# EAGLE design 3DAGM (EAGLE 6.6.0)
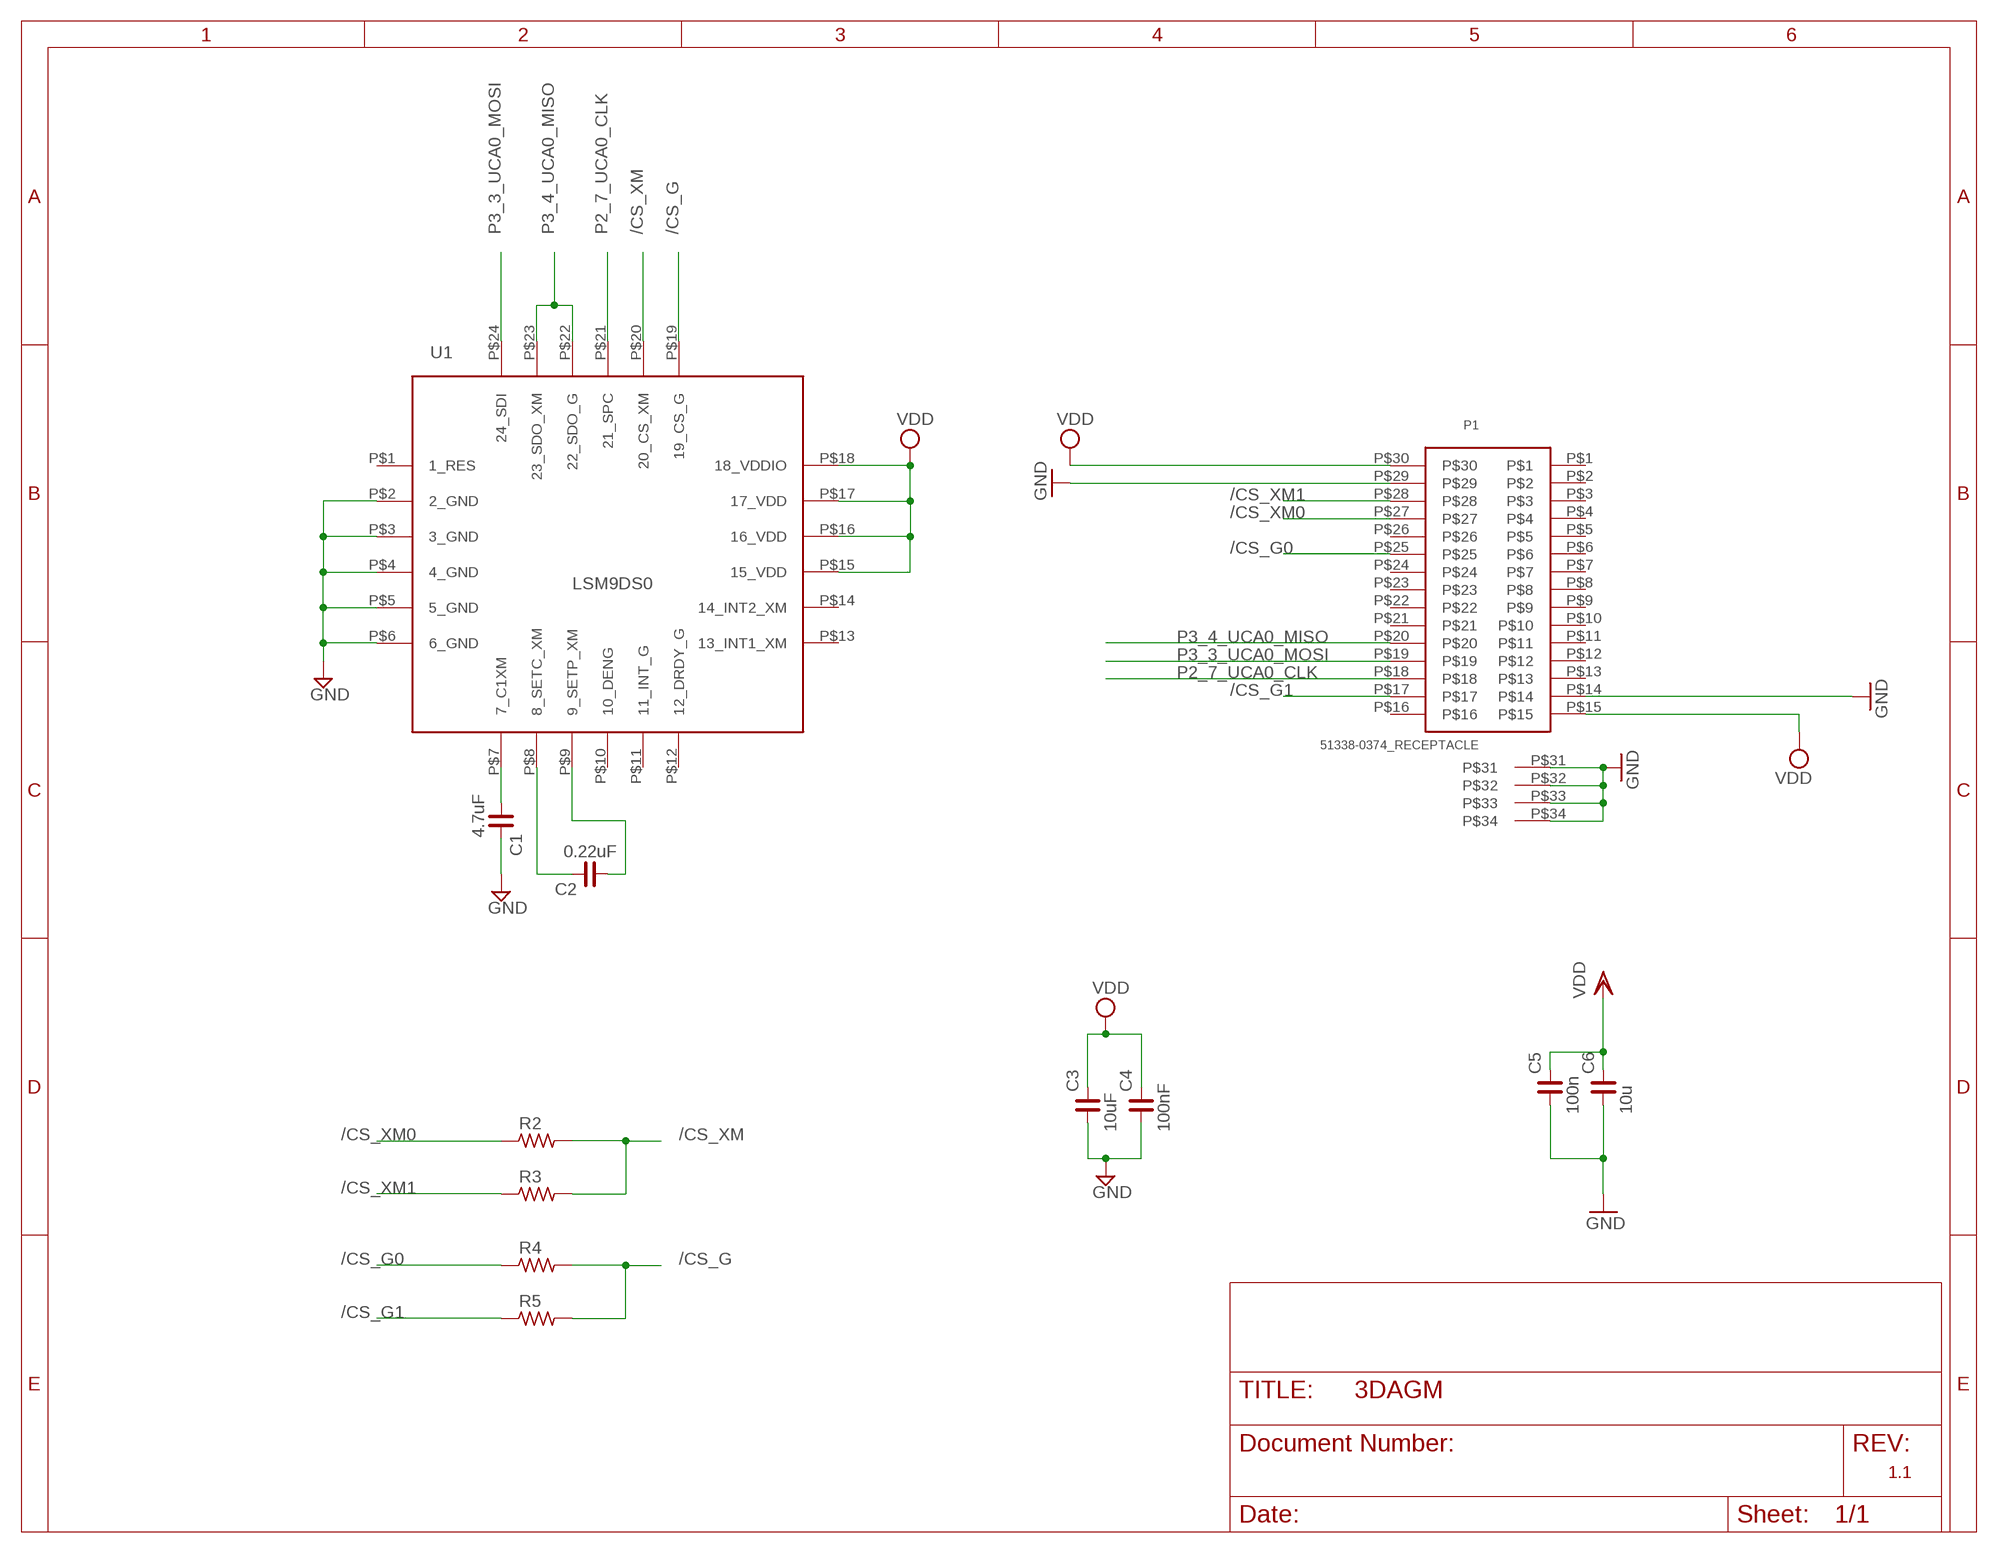
[diagram p0: schematic, sheet 1]

## Parts
C1  4.7uF  C_0402  [C0402]
C2  0.22uF  C_0402  [C0402]
C3  10uF  C_0402  [C0402]
C4  100nF  C_0402  [C0402]
C5  100n  C_0402  [C0402]
C6  10u  C_0402  [C0402]
P1  51338-0374_RECEPTACLE  [51338-0374_RECEPTACLE]
R2  R_0402  [R0402]
R3  R_0402  [R0402]
R4  R_0402  [R0402]
R5  R_0402  [R0402]
U$1  LSM9DS09DOFS0  [LGA24(4X4X1)]

## Nets
/CS_G: R4.2 R5.2 U$1.P$19(19_CS_G)
/CS_G0: P1.P$25 R4.1
/CS_G1: P1.P$17 R5.1
/CS_XM: R2.2 R3.2 U$1.P$20(20_CS_XM)
/CS_XM0: P1.P$27 R2.1
/CS_XM1: P1.P$28 R3.1
GND: C1.2 C3.1 C4.1 C5.1 C6.1 P1.P$14 P1.P$29 P1.P$31 P1.P$32 P1.P$33 P1.P$34 U$1.P$2(2_GND) U$1.P$3(3_GND) U$1.P$4(4_GND) U$1.P$5(5_GND) U$1.P$6(6_GND)
N$1: C1.1 U$1.P$7(7_C1XM)
N$2: C2.2 U$1.P$8(8_SETC_XM)
N$3: C2.1 U$1.P$9(9_SETP_XM)
P2_7_UCA0_CLK: P1.P$18 U$1.P$21(21_SPC)
P3_3_UCA0_MOSI: P1.P$19 U$1.P$24(24_SDI)
P3_4_UCA0_MISO: P1.P$20 U$1.P$22(22_SDO_G) U$1.P$23(23_SDO_XM)
VDD: C3.2 C4.2 C5.2 C6.2 P1.P$15 P1.P$30 U$1.P$15(15_VDD) U$1.P$16(16_VDD) U$1.P$17(17_VDD) U$1.P$18(18_VDDIO)
Unconnected: P1.P$1 P1.P$2 P1.P$3 P1.P$4 P1.P$5 P1.P$6 P1.P$7 P1.P$8 P1.P$9 P1.P$10 P1.P$11 P1.P$12 P1.P$13 P1.P$16 P1.P$21 P1.P$22 P1.P$23 P1.P$24 P1.P$26 U$1.P$1(1_RES) U$1.P$10(10_DENG) U$1.P$11(11_INT_G) U$1.P$12(12_DRDY_G) U$1.P$13(13_INT1_XM) U$1.P$14(14_INT2_XM)

## Notes on the sheet
- U1
- 1.1

## Library data of the parts
C1-C6 = rc-master-smd:C_: NON-POLARIZED CAP
P1 = Molex_SlimStack:51338-0374_RECEPTACLE
R2-R5 = rc-master-smd:R_: RESISTOR
U$1 = lsm9ds0:LSM9DS0

## Board
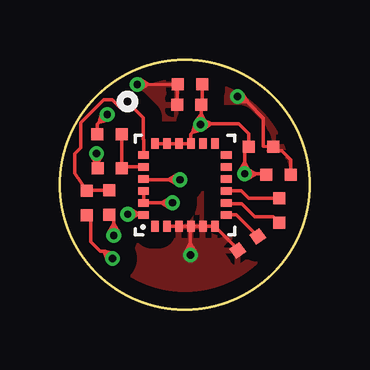
[diagram p1: board, top side]
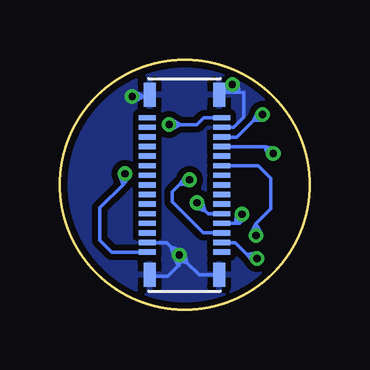
[diagram p2: board, bottom side, seen from below]

Size 10.4 x 10.4 mm. Coordinates in mm from the lower left corner, seen from the top.
Outline: circle at 5.2,5.2 radius 5.2
Copper layers (1*16): Top 0.035mm / dielectric 1.5mm / Bottom 0.035mm
Design rules "DIRTY_PCB": minimum track width 5mil, minimum drill 12mil, track to track 5mil, track to pad 5mil, pad to pad 5mil, via to via 5mil, smd to smd 0mil, copper to edge 10mil, drill to drill 10mil, minimum pad ring 10mil, minimum via ring 6mil, stop-mask expansion 2mil, vias tented up to drill 25mil, thermal gap 10mil

### Footprints (pad centres in the part's own frame; a part is rotated, then mirrored left to right if it is on the bottom)
C0402 = smd 0.5 x 0.5: 1 -0.508,0; 2 0.508,0
51338-0374_RECEPTACLE = smd 0.7 x 0.22: P$1 -1.55,2.8; P$2 -1.55,2.4; P$3 -1.55,2; P$4 -1.55,1.6; P$5 -1.55,1.2; P$6 -1.55,0.8; P$7 -1.55,0.4; P$8 -1.55,0; P$9 -1.55,-0.4; P$10 -1.55,-0.8; P$11 -1.55,-1.2; P$12 -1.55,-1.6; P$13 -1.55,-2; P$14 -1.55,-2.4; P$15 -1.55,-2.8; P$16 1.55,-2.8; P$17 1.55,-2.4; P$18 1.55,-2; P$19 1.55,-1.6; P$20 1.55,-1.2; P$21 1.55,-0.8; P$22 1.55,-0.4; P$23 1.55,0; P$24 1.55,0.4; P$25 1.55,0.8; P$26 1.55,1.2; P$27 1.55,1.6; P$28 1.55,2; P$29 1.55,2.4; P$30 1.55,2.8 | smd 0.5 x 1: P$31 1.45,3.75; P$32 -1.45,3.75; P$33 -1.45,-3.75; P$34 1.45,-3.75
R0402 = smd 0.5 x 0.5: 1 -0.508,0; 2 0.508,0
LGA24(4X4X1) = smd 0.45 x 0.3: P$1 -1.725,1.25; P$2 -1.725,0.75; P$3 -1.725,0.25; P$4 -1.725,-0.25; P$5 -1.725,-0.75; P$6 -1.725,-1.25; P$13 1.725,-1.25; P$14 1.725,-0.75; P$15 1.725,-0.25; P$16 1.725,0.25; P$17 1.725,0.75; P$18 1.725,1.25 | smd 0.3 x 0.45: P$7 -1.25,-1.725; P$8 -0.75,-1.725; P$9 -0.25,-1.725; P$10 0.25,-1.725; P$11 0.75,-1.725; P$12 1.25,-1.725; P$19 1.25,1.725; P$20 0.75,1.725; P$21 0.25,1.725; P$22 -0.25,1.725; P$23 -0.75,1.725; P$24 -1.25,1.725

### Placement (x,y rotation side)
C1  7.82,2.76 215 top
C2  9.14,4.12 270 top
C3  5.39,8.54 0 top
C4  5.42,9.4 0 top
C5  9.11,5.63 180 top
C6  8.38,6.78 180 top
P1  5.21,5.19 0 bottom
R2  2.07,5.9 0 top
R3  2.07,7.3 0 top
R4  2.06,4.47 90 top
R5  1.12,4.44 90 top
U$1  5.21,5.19 90 top

### Tracks (layer width: path | path; a pad name or v marks a point on that pad's centre or on a via)
/CS_G
  Top 0.152: R4.2 1.33,4.97 R5.2 0.62,5.67 0.62,6.5 0.87,6.75 0.87,7.78 1.83,8.74 2.19,8.74 2.52,8.41 3,8.41 3.03,8.44 3.47,8 3.47,7.1 3.48,7.09 U$1.P$19
/CS_G0  (via drill 0.3)
  Top 0.152: R4.1 2.24,3.94 2.24,3.55 | 2.24,3.55 v2.24,3.09 | 2.24,3.55 2.04,3.21 v2.24,3.09 | 2.24,3.55 2.44,3.21 v2.24,3.09
  Bottom 0.152: P1.P$25 2.14,6 1.62,5.48 1.62,4.2 2.24,3.58 2.24,3.55 | 2.24,3.55 v2.24,3.09 | 2.24,3.55 2.04,3.21 v2.24,3.09 | 2.24,3.55 2.44,3.21 v2.24,3.09
/CS_G1  (via drill 0.3)
  Top 0.152: R5.1 1.29,3.96 1.29,2.82 1.67,2.44 1.85,2.44 | 1.85,2.44 1.89,2.44 v2.19,2.13 | 1.85,2.44 1.97,2.06 v2.19,2.13 | 1.85,2.44 2.23,2.36 v2.19,2.13
  Bottom 0.152: 3.73,2.82 3.7,2.8 P1.P$17 3.09,2.8 2.61,2.31 | 2.61,2.31 2.43,2.13 v2.19,2.13 | 2.61,2.31 2.22,2.36 v2.19,2.13 | 2.61,2.31 2.37,2 v2.19,2.13
/CS_XM
  Top 0.152: U$1.P$20 2.63,5.94 R2.2 2.58,6.41 R3.2
/CS_XM0  (via drill 0.3)
  Top 0.152: R2.1 1.52,5.94 1.52,6.05 | 1.52,6.05 v1.52,6.5 | 1.52,6.05 1.71,6.39 v1.52,6.5 | 1.52,6.05 1.32,6.39 v1.52,6.5
  Bottom 0.152: v1.52,6.5 1.81,6.8 1.87,6.8 | 1.87,6.8 P1.P$27 | 1.87,6.8 1.48,6.73 v1.52,6.5 | 1.87,6.8 1.73,6.42 v1.52,6.5
/CS_XM1  (via drill 0.3)
  Top 0.152: R3.1 1.56,7.72 1.64,7.8 | 1.64,7.8 v1.97,8.12 | 1.64,7.8 2.03,7.9 v1.97,8.12 | 1.64,7.8 1.75,8.18 v1.97,8.12
  Bottom 0.152: P1.P$28 3.03,7.19 2.35,7.87 | v1.97,8.12 2.1,8.12 2.35,7.87 | 2.35,7.87 2.17,8.23 v1.97,8.12 | 2.35,7.87 1.95,7.9 v1.97,8.12
GND  (via drill 0.3)
  Top 0.127: v3.22,9.38 3.68,9.38 | 3.68,9.38 4.9,9.38 C4.1 | 3.68,9.38 3.35,9.59 v3.22,9.38 | 3.68,9.38 3.35,9.18 v3.22,9.38
  Top 0.152: C1.2 7.41,2.52 U$1.P$6 U$1.P$5 U$1.P$4 | U$1.P$2 U$1.P$3 U$1.P$4 | v5.43,2.28 5.43,2.74 | 5.43,2.74 5.43,3.44 U$1.P$4 | C3.1 4.88,9.36 C4.1 | 7.79,8.66 8.48,7.97 8.48,6.81 C6.1 8.67,6.61 9.24,6.61 9.61,6.24 C5.1 | 7.79,8.66 7.57,8.88 v7.39,8.88 | 5.43,2.74 5.23,2.4 v5.43,2.28 | 5.43,2.74 5.63,2.4 v5.43,2.28 | 7.79,8.66 7.59,8.99 v7.39,8.88 | 7.79,8.66 7.4,8.65 v7.39,8.88
  Bottom 0.127: 3.58,9.13 arc-90 3.51,9.05 3.27,9.05 | 3.27,9.05 2.91,9.05 | 2.91,9.05 2.75,9.05 | v3.22,9.38 3.22,9.1 3.27,9.05 | 2.91,9.05 3.28,9.15 v3.22,9.38 | 2.91,9.05 2.98,9.43 v3.22,9.38
  Bottom 0.152: P1.P$14 5.95,2.8 5.76,2.6 | 5.76,2.6 v5.43,2.28 | P1.P$34 4.6,1.45 5.11,1.96 | 5.11,1.96 v5.43,2.28 | 3.58,9.13 3.59,9.12 | 3.59,9.12 P1.P$31 | P1.P$29 3.16,7.6 2.75,8.01 2.75,9.05 | P1.P$32 6.73,8.88 6.94,8.88 | 6.94,8.88 v7.39,8.88 | P1.P$33 6.6,1.38 5.91,1.38 5.46,1.82 | 5.46,1.82 5.43,1.86 v5.43,2.28 | 5.76,2.6 5.37,2.5 v5.43,2.28 | 5.76,2.6 5.65,2.22 v5.43,2.28 | 5.11,1.96 5.49,2.06 v5.43,2.28 | 5.11,1.96 5.21,2.34 v5.43,2.28 | 5.46,1.82 5.64,2.18 v5.43,2.28 | 5.46,1.82 5.24,2.15 v5.43,2.28 | 3.59,9.12 3.43,9.48 v3.22,9.38 3.2,9.16 3.59,9.12 | 6.94,8.88 7.28,8.68 v7.39,8.88 | 6.94,8.88 7.28,9.07 v7.39,8.88
  pour Bottom (isolate 0.25): 5.22,10.1 arc-90 10.12,5.2 arc-90 5.22,0.3 arc-90 0.32,5.2 arc-90
  pour Top (isolate 0.7): 5.22,10.08 arc-90 10.12,5.18 arc-90 5.22,0.28 arc-90 0.32,5.18 arc-90
N$1
  Top 0.152: U$1.P$7 7.34,3.94 C1.1
N$2
  Top 0.152: U$1.P$8 6.97,4.41 7.57,4.41 8.11,3.86 8.89,3.86 C2.2
N$3
  Top 0.152: U$1.P$9 7.56,4.95 7.87,4.63 C2.1
P2_7_UCA0_CLK  (via drill 0.3)
  Top 0.152: U$1.P$21 3.51,5.41 4.54,5.41 | 4.54,5.41 4.68,5.41 v5,5.41 | 4.54,5.41 4.88,5.21 v5,5.41 | 4.54,5.41 4.88,5.61 v5,5.41
  Bottom 0.152: P1.P$18 4.43,3.2 5.73,4.49 5.73,4.92 5.42,5.23 | 5.42,5.23 5.23,5.41 v5,5.41 | 5.42,5.23 5.18,5.55 v5,5.41 | 5.42,5.23 5.02,5.18 v5,5.41
P3_3_UCA0_MOSI  (via drill 0.3)
  Top 0.152: U$1.P$24 3.45,3.97 3.28,3.97 | 3.28,3.97 v2.82,3.97 | 3.28,3.97 2.94,4.17 v2.82,3.97 | 3.28,3.97 2.94,3.78 v2.82,3.97
  Bottom 0.152: v2.82,3.97 2.86,3.92 2.86,3.66 2.92,3.6 3.08,3.6 | 3.08,3.6 P1.P$19 | 3.08,3.6 3.05,3.99 v2.82,3.97 | 3.08,3.6 2.72,3.77 v2.82,3.97
P3_4_UCA0_MISO  (via drill 0.3)
  Top 0.152: U$1.P$22 U$1.P$23 3.5,4.42 3.54,4.45 4.23,4.45 | 4.23,4.45 v4.69,4.45 | 4.23,4.45 4.57,4.25 v4.69,4.45 | 4.23,4.45 4.57,4.65 v4.69,4.45
  Bottom 0.152: P1.P$20 4.23,4 4.37,4.13 | 4.37,4.13 v4.69,4.45 | 4.37,4.13 4.75,4.23 v4.69,4.45 | 4.37,4.13 4.47,4.51 v4.69,4.45
VDD  (via drill 0.3)
  Top 0.152: v7.7,5.66 8.15,5.66 | 8.15,5.66 8.57,5.66 C5.2 | U$1.P$18 U$1.P$17 U$1.P$16 U$1.P$15 5.46,7.32 5.53,7.39 | v5.85,7.71 5.89,7.75 | 5.89,7.75 5.89,8.17 | 5.89,8.17 C3.2 5.93,8.58 C4.2 | 5.53,7.39 v5.85,7.71 | 5.89,7.75 6.31,7.75 | 6.31,7.75 7.03,7.75 7.04,7.75 7.46,7.75 7.87,7.33 C6.2 7.7,6.58 7.7,6.12 | 7.7,6.12 v7.7,5.66 | 8.15,5.66 7.81,5.86 v7.7,5.66 | 8.15,5.66 7.81,5.46 v7.7,5.66 | 7.7,6.12 7.5,5.77 v7.7,5.66 | 7.7,6.12 7.89,5.77 v7.7,5.66 | 5.89,8.17 5.67,7.84 v5.85,7.71 | 5.89,8.17 6.06,7.81 v5.85,7.71 | 5.53,7.39 5.91,7.49 v5.85,7.71 | 5.53,7.39 5.63,7.77 v5.85,7.71 | 6.31,7.75 5.95,7.92 v5.85,7.71 | 6.31,7.75 5.98,7.52 v5.85,7.71
  Bottom 0.152: P1.P$15 8.24,2.4 8.74,2.89 8.74,4.24 7.77,5.21 | 7.77,5.21 7.7,5.28 v7.7,5.66 | P1.P$30 4.42,8 4.71,7.71 5.39,7.71 | 5.39,7.71 v5.85,7.71 | 7.77,5.21 7.91,5.58 v7.7,5.66 | 7.77,5.21 7.52,5.51 v7.7,5.66 | 5.39,7.71 5.74,7.51 v5.85,7.71 | 5.39,7.71 5.74,7.91 v5.85,7.71